# EAGLE schematic LED_RGB (EAGLE 7.2.0)
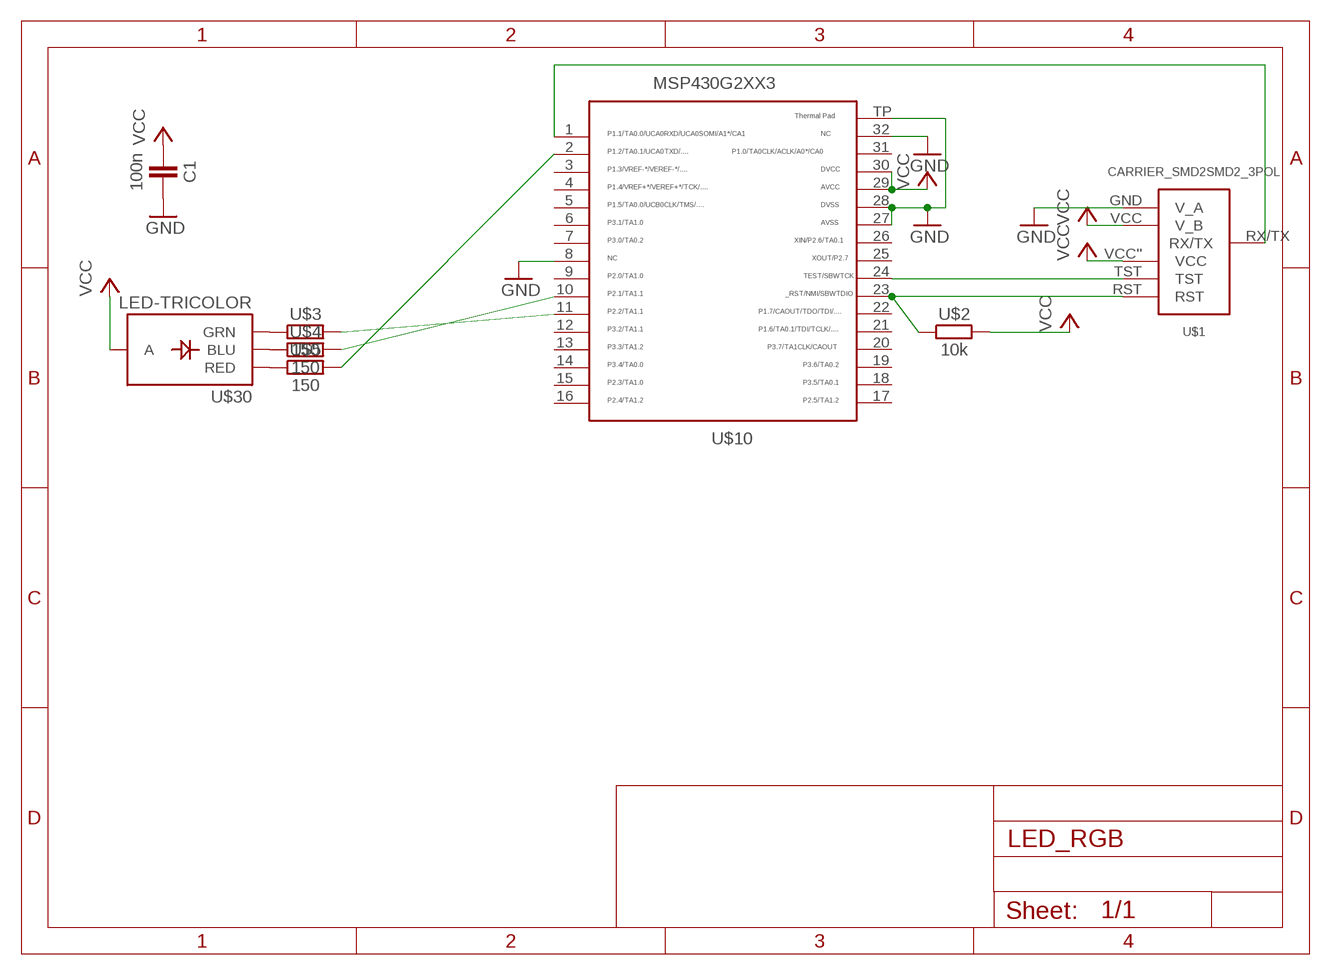
[diagram p0: schematic, sheet 1]

## Parts
C1  100n  CAPACITOR  [603]
U$1  CARRIER_SMD2SMD2_3POL  [CARRIER_SMD2_3POL]
U$2  10k  RESISTOR0603  [603]
U$3  150  RESISTOR0603  [603]
U$4  150  RESISTOR0603  [603]
U$5  150  RESISTOR0603  [603]
U$10  MSP430G2553  [QFN32]
U$30  LED-TRICOLOR  [LED-TRICOLOR-SMD]

## Nets
GND: C1.2 U$1.GND(V_A) U$10.8 U$10.27 U$10.28 U$10.32 U$10.TP
N$2: U$3.1 U$30.G(GRN)
N$3: U$1.TST U$10.24
N$4: U$1.RST U$2.1 U$10.23
N$5: U$4.1 U$30.B(BLU)
N$6: U$5.1 U$30.R(RED)
N$7: U$4.2 U$10.10
N$11: U$5.2 U$10.2
N$12: U$1.RX/TX U$10.1
N$13: U$3.2 U$10.11
VCC: C1.1 U$1.VCC''(VCC) U$1.VCC(V_B) U$2.2 U$10.29 U$10.30 U$30.A
Unconnected: U$10.3 U$10.4 U$10.5 U$10.6 U$10.7 U$10.9 U$10.12 U$10.13 U$10.14 U$10.15 U$10.16 U$10.17 U$10.18 U$10.19 U$10.20 U$10.21 U$10.22 U$10.25 U$10.26 U$10.31

## Library data of the parts
C1 = thar:CAPACITOR
U$1 = thar:CARRIER_SMD2
U$2-U$5 = thar:RESISTOR
U$10 = thar:MSP430G2553: TEXAS INSTRUMENTS MSP430G2553IRHB32R MCU, 16BIT, MSP430, 16MHZ, QFN-32 Farnell Best.Nr.: 2325726 Herst.Bez.: MSP430G2553IRHB32R
U$30 = SparkFun-LED:LED-TRICOLOR: Tri-Color LED SMD Proven layout and schematic for triple color LED in SMD package - common anode. Spark Fun Electronics SKU : COM-07844